# EAGLE design XX-Piezo-Receiver (EAGLE 8.7.0)
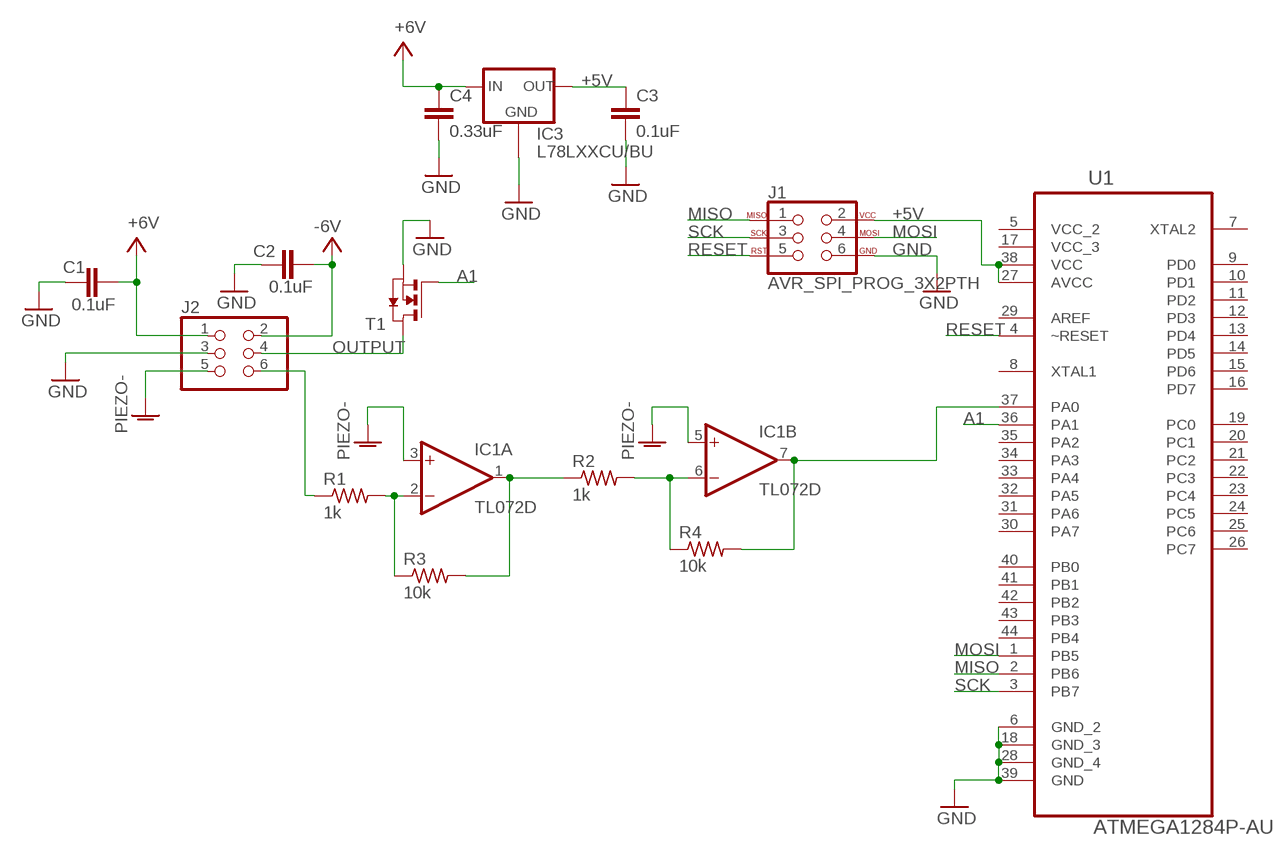
[diagram p0: schematic, sheet 1]

## Parts
C1  0.1uF  C-EUC0603  [C0603]
C2  0.1uF  C-EUC0603  [C0603]
C3  0.1uF  C-EUC0603  [C0603]
C4  0.33uF  C-EUC0603  [C0603]
IC1  TL072D  [SO08]
IC3  L78LXXCU/BU  [SOT89]
J1  AVR_SPI_PROG_3X2PTH  [2X3]
J2  PINHD-2X3  [2X03]
R1  1k  R-US_R0603  [R0603]
R2  1k  R-US_R0603  [R0603]
R3  10k  R-US_R0603  [R0603]
R4  10k  R-US_R0603  [R0603]
T1  NMOSSOT23  [SOT-23]
U1  ATMEGA1284P-AU  [QFP80P1200X1200X120-44N]

## Nets
+5V: C3.1 IC3.1(OUT) J1.2 U1.27(AVCC) U1.38(VCC)
+6V: C1.2 C4.1 IC3.3(IN) J2.1
-6V: C2.2 J2.2
A1: T1.3(G) U1.36(PA1)
GND: C1.1 C2.1 C3.2 C4.2 IC3.4(GND1) J1.6 J2.3 T1.2(S) U1.6(GND_2) U1.18(GND_3) U1.28(GND_4) U1.39(GND)
MISO: J1.1 U1.2(PB6)
MOSI: J1.4 U1.1(PB5)
OUT1: IC1.1(A:OUT) R2.1 R3.2
OUT2: IC1.7(B:OUT) R4.2 U1.37(PA0)
OUTPUT: J2.4 T1.1(D)
PIEZO+: J2.6 R1.1
PIEZO+1: IC1.2(A:-IN) R1.2 R3.1
PIEZO+2: IC1.6(B:-IN) R2.2 R4.1
PIEZO-: IC1.3(A:+IN) IC1.5(B:+IN) J2.5
RESET: J1.5 U1.4(~RESET)
SCK: J1.3 U1.3(PB7)
Unconnected: IC3.2(GND) U1.7(XTAL2) U1.8(XTAL1) U1.9(PD0) U1.10(PD1) U1.11(PD2) U1.12(PD3) U1.13(PD4) U1.14(PD5) U1.15(PD6) U1.16(PD7) U1.19(PC0) U1.20(PC1) U1.21(PC2) U1.22(PC3) U1.23(PC4) U1.24(PC5) U1.25(PC6) U1.26(PC7) U1.29(AREF) U1.30(PA7) U1.31(PA6) U1.32(PA5) U1.33(PA4) U1.34(PA3) U1.35(PA2) U1.40(PB0) U1.41(PB1) U1.42(PB2) U1.43(PB3) U1.44(PB4)

## Power pins joined to a net without a drawn wire
+6V: IC1.8(P:V+)
-6V: IC1.4(P:V-)
VCC_2: U1.5(VCC_2)
VCC_3: U1.17(VCC_3)

## Library data of the parts
C1-C4 = rcl:C-EU: CAPACITOR, European symbol; SPICEPREFIX: C
IC1 = linear3:TL072: OP AMP
IC3 = v-reg-3:L78LXXCU/BU: VOLTAGE REGULATOR
J1 = SparkFun-Connectors:AVR_SPI_PROG_3X2: AVR ISP 6 Pin This is the reduced ISP connector for AVR programming. Common on Arduino. This footprint will take up less PCB space and can be used with a 10-pin to 6-pin adapter such as SKU: BOB-08508 **Special note about "TEST_POINT" package. The stop mask is on the top side, so if you want your programming test points to be on the bottom of your board, make sure to place this package on the bottom side of the board. This also ensure that the orientation to program from the bottom side will be correct. SparkFun Products: SparkFun ISP Pogo Adapter <https://www.sparkfun.com/products/11591> - NS Tiny AVR Programmer <https://www.sparkfun.com/products/11801> -PTH
J2 = SparkFun-Retired:PINHD-2X3: PIN HEADER
R1-R4 = rcl:R-US_: RESISTOR, American symbol; SPICEPREFIX: R
T1 = zetex:NMOSSOT23: MOS FET; OC_FARNELL: unknown; OC_NEWARK: unknown
U1 = Atmel_By_element14_Batch_1-00:ATMEGA1284P-AU: Microcontroller with Programmable Flash; MPN: ATMEGA1284P-AU; OC_FARNELL: 1715480; OC_NEWARK: 15R0263; PACKAGE: TQFP-44; SUPPLIER: Atmel

## Board
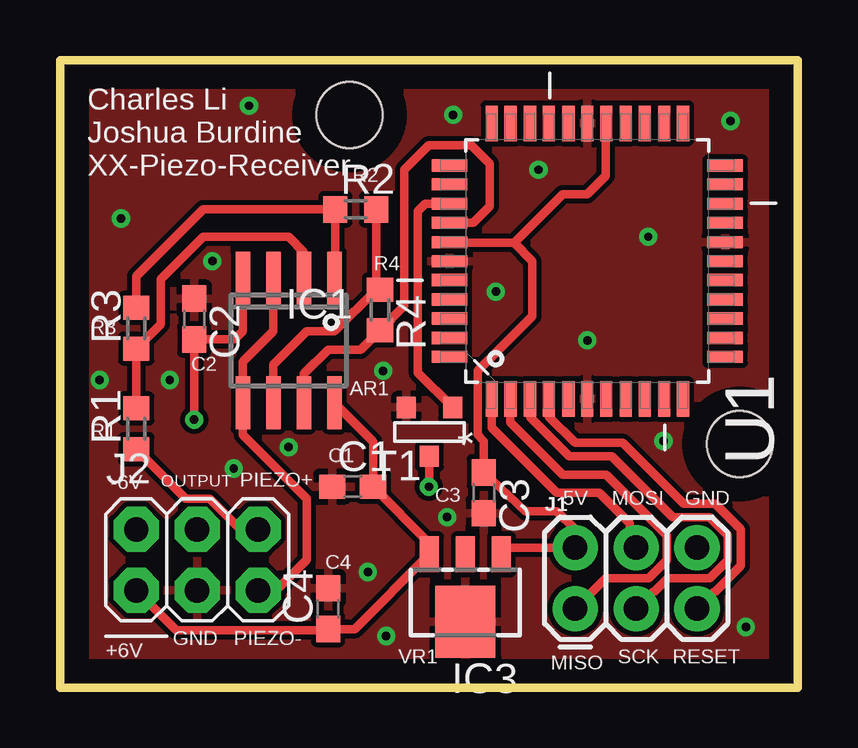
[diagram p1: board, top side]
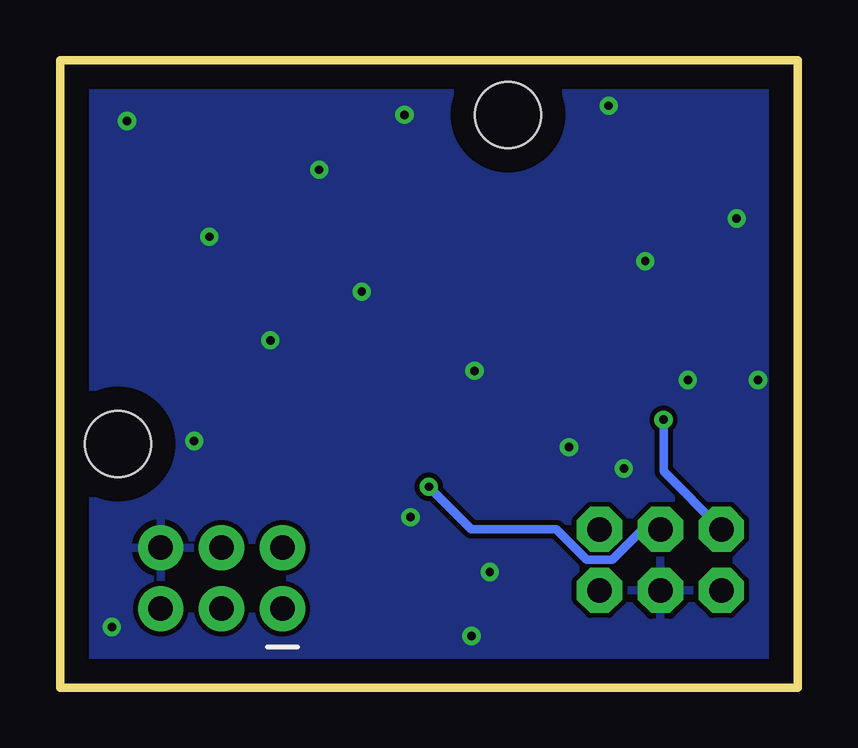
[diagram p2: board, bottom side, seen from below]

Size 30.73 x 26.16 mm. Coordinates in mm from the lower left corner, seen from the top.
Outline: 30.73,26.16 0,26.16 0,0 30.73,0 30.73,26.16
Copper layers (1*16): Top 0.035mm / dielectric 1.5mm / Bottom 0.035mm
Design rules "default *": minimum track width 6mil, minimum drill 0.35mm, track to track 8mil, track to pad 6mil, pad to pad 6mil, via to via 6mil, smd to smd 6mil, copper to edge 40mil, drill to drill 6mil, minimum pad ring 10mil, minimum via ring 8mil, stop-mask expansion 4mil, vias tented up to drill 0mil, thermal gap 10mil
Holes 2.75 mm at 28.32,10.16 12.06,23.88

### Footprints (pad centres in the part's own frame; a part is rotated, then mirrored left to right if it is on the bottom)
C0603 = smd 1.1 x 1: 1 -0.85,0; 2 0.85,0
SO08 = smd 0.6 x 2.2: 1 -1.905,-2.6; 2 -0.635,-2.6; 3 0.635,-2.6; 4 1.905,-2.6; 5 1.905,2.6; 6 0.635,2.6; 7 -0.635,2.6; 8 -1.905,2.6
SOT89 = smd 0.8 x 1.5: 1 -1.5,-1.75; 2 0,-1.75; 3 1.5,-1.75 | smd 2.5 x 3: 4 0,1.05
2X3 = drill 1.016 pad 1.88: 1 0,0; 2 0,2.54; 3 2.54,0; 4 2.54,2.54; 5 5.08,0; 6 5.08,2.54
2X03 = drill 1.016 pad 1.88 octagon: 1 -2.54,-1.27; 2 -2.54,1.27; 3 0,-1.27; 4 0,1.27; 5 2.54,-1.27; 6 2.54,1.27
R0603 = smd 1 x 1.1: 1 -0.85,0; 2 0.85,0
SOT-23 = smd 0.787 x 0.889: 1 0.025,-1.016; 2 -0.94,1.016; 3 0.991,1.016
QFP80P1200X1200X120-44N = smd 1.473 x 0.508: 1 -5.74,3.988; 2 -5.74,3.2; 3 -5.74,2.388; 4 -5.74,1.6; 5 -5.74,0.787; 6 -5.74,0; 7 -5.74,-0.787; 8 -5.74,-1.6; 9 -5.74,-2.388; 10 -5.74,-3.2; 11 -5.74,-3.988; 23 5.74,-3.988; 24 5.74,-3.2; 25 5.74,-2.388; 26 5.74,-1.6; 27 5.74,-0.787; 28 5.74,0; 29 5.74,0.787; 30 5.74,1.6; 31 5.74,2.388; 32 5.74,3.2; 33 5.74,3.988 | smd 0.508 x 1.473: 12 -3.988,-5.74; 13 -3.2,-5.74; 14 -2.388,-5.74; 15 -1.6,-5.74; 16 -0.787,-5.74; 17 0,-5.74; 18 0.787,-5.74; 19 1.6,-5.74; 20 2.388,-5.74; 21 3.2,-5.74; 22 3.988,-5.74; 34 3.988,5.74; 35 3.2,5.74; 36 2.388,5.74; 37 1.6,5.74; 38 0.787,5.74; 39 0,5.74; 40 -0.787,5.74; 41 -1.6,5.74; 42 -2.388,5.74; 43 -3.2,5.74; 44 -3.988,5.74

### Placement (x,y rotation side)
C1  12.19,8.38 0 top
C2  5.59,15.37 270 top
C3  17.65,8.13 270 top
C4  11.18,3.3 90 top
IC1  9.53,14.48 180 top
IC3  16.89,3.81 180 top
J1  21.46,3.3 0 top
J2  5.71,5.33 0 top
R1  3.17,10.79 90 top
R2  12.32,19.94 0 top
R3  3.17,14.99 90 top
R4  13.34,15.75 270 top
T1  15.37,10.67 0 top
U1  21.97,17.78 90 top

### Tracks (layer width: path | path; a pad name or v marks a point on that pad's centre or on a via)
+5V
  Top 0.356: U1.27 22.73,23.5 22.73,21.34 21.97,20.57 20.95,20.57 18.92,18.54 | U1.38 16.26,18.54 18.92,18.54 | 18.92,18.54 19.68,17.78 19.68,15.49 17.4,13.21 17.4,10.54 17.65,10.29 C3.1 | IC3.1 18.67,5.84 J1.2 21.46,6.6 20.7,7.37 19.39,7.37 C3.1 | 17.4,9.36 C3.1
+6V
  Top 0.356: J2.1 4.84,2.4 11.12,2.4 C4.1 12.28,2.45 IC3.3 | IC3.3 15.39,5.95 | 13.04,8.29 C1.2 | IC1.8 13.04,10.27 C1.2 | C1.2 15.39,6.03 IC3.3
-6V  (via drill 0.35)
  Top 0.356: IC1.4 7.62,14.86 7.28,14.52 C2.2 v5.59,11.18
  Bottom 0.356: J2.2 5.59,9.02 v5.59,11.18
A1
  Top 0.356: U1.36 15.21,20.17 14.91,19.86 14.91,13.13 T1.3
GND  (via drill 0.35)
  other vias: 7.24,9.14 13.46,13.21 2.54,19.56 4.57,12.83 28.57,2.54 9.53,10.03 27.94,23.62 7.87,24.26 19.94,21.59 18.16,16.51 16.38,23.88 24.51,18.8 1.65,12.83 21.97,14.48 16.13,7.11 6.35,17.78 13.59,2.16 12.83,4.83 25.15,10.29
  pour Top: 0,26.16 0,0 30.73,0 30.73,26.16
  pour Bottom: 0,0 30.73,0 30.73,26.16 0,26.16
MISO
  Top 0.356: U1.2 18.77,11.07 20.95,8.89 22.75,8.89 25.27,6.37 25.27,5.32 24.53,4.57 22.73,4.57 J1.1
MOSI
  Top 0.356: U1.1 17.98,10.85 20.7,8.13 22.48,8.13 23.75,6.86 23.75,6.1 J1.4
OUT1
  Top 0.356: R3.2 3.17,17.14 5.97,19.94 R2.1 11.47,17.12 IC1.1
OUT2
  Top 0.356: U1.37 17.22,19.38 17.91,20.07 17.91,21.84 17.14,22.61 15.37,22.61 14.35,21.59 14.35,15.91 R4.2 12.53,14.1 11.18,14.1 10.16,13.08 IC1.7
OUTPUT  (via drill 0.35)
  Top 0.356: T1.1 15.39,8.41 v15.37,8.38
  Bottom 0.356: v15.37,8.38 13.59,6.6 10.05,6.6 8.78,5.33 7.73,5.33 6.46,6.6 J2.4
PIEZO+
  Top 0.356: R1.1 5.25,7.87 6.24,7.87 7.51,6.6 J2.6
PIEZO+1
  Top 0.356: IC1.2 10.16,18.16 9.53,18.8 5.97,18.8 4.19,17.02 4.19,15.15 R3.1 R1.2
PIEZO+2
  Top 0.356: IC1.6 8.89,13.46 10.29,14.86 11.43,14.86 13.17,16.6 | 13.17,16.6 R4.1 | R2.2 13.17,16.6
PIEZO-
  Top 0.356: J2.5 9.02,4.06 10.29,5.33 10.29,7.87 7.62,10.54 IC1.5 7.62,13.59 8.51,14.48 8.76,14.73 8.89,14.86 IC1.3
RESET
  Top 0.356: U1.4 20.37,11.3 21.46,10.21 23.44,10.21 25.98,7.67 27.3,7.67 28.37,6.6 28.37,5.08 27.3,4.01 27.25,4.01 J1.5
SCK
  Top 0.356: U1.3 19.58,11.28 21.21,9.65 22.99,9.65 25.53,7.11 27.07,7.11 27.81,6.37 27.81,5.32 27.07,4.57 25.32,4.57 24.76,4.01 24.71,4.01 J1.3

### Text on the board
tPlace: Charles Li / Joshua Burdine / XX-Piezo-Receiver | R2 | R4 | R3 | C2 | AR1 | R1 | -6V | C1 | OUTPUT | PIEZO+ | C3 | 5V | MOSI | GND | C4 | GND | PIEZO- | +6V | VR1 | MISO | SCK | RESET